# EAGLE schematic eCog_Buses_Template (EAGLE 6.6.0)
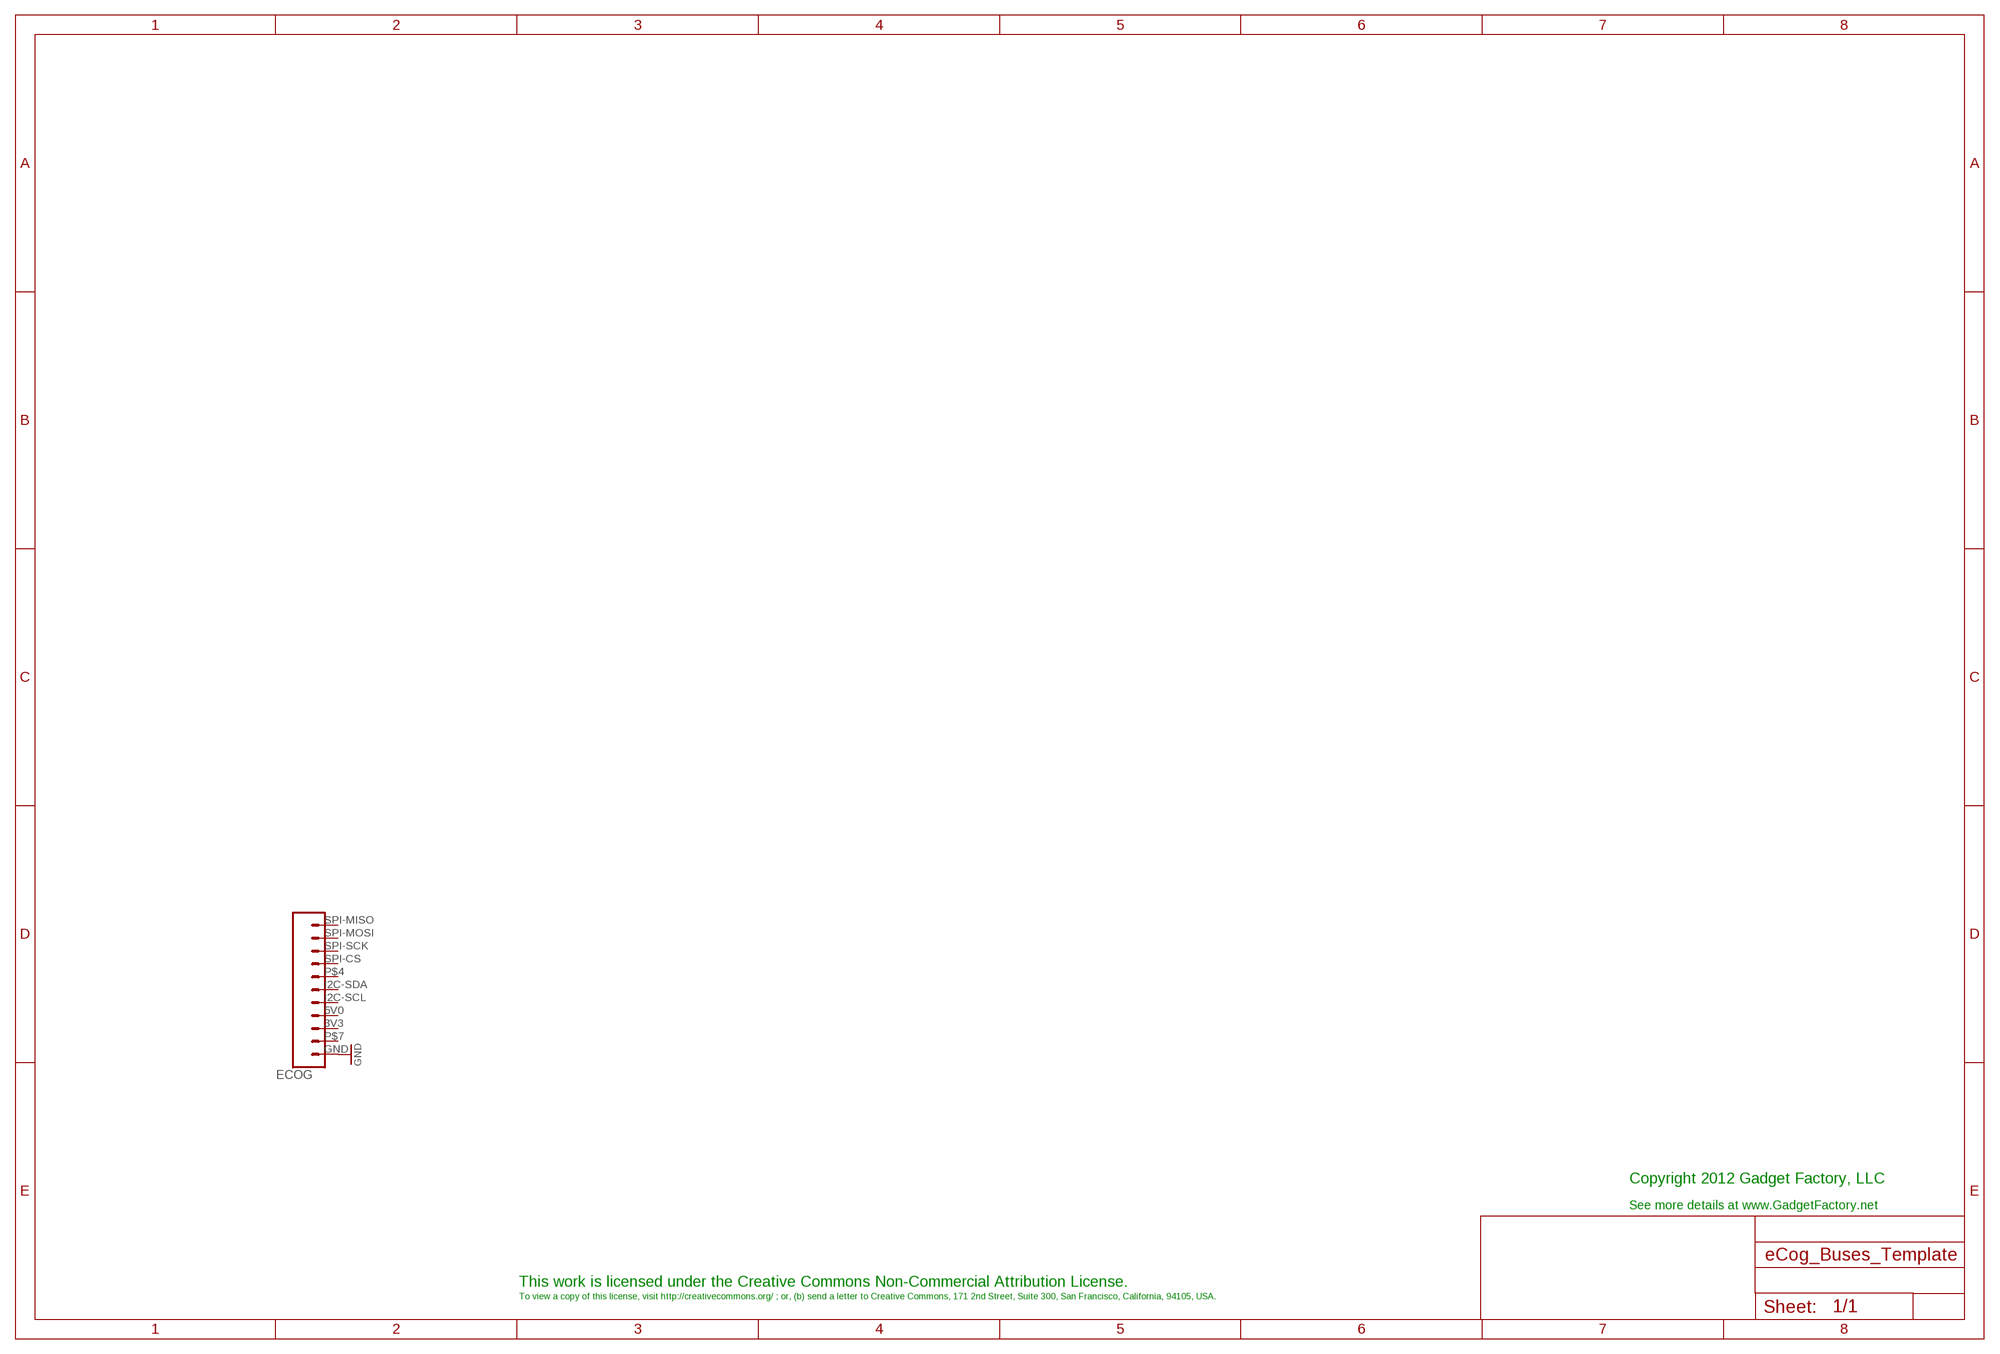
[diagram p0: schematic, sheet 1]

## Parts
ECOG  ECOG_BUSES_ROWECOG_BUSES_SMD  [ECOG_BUSES_SMD]

## Nets
GND: ECOG.GND
Unconnected: ECOG.3V3 ECOG.5V0(5V) ECOG.I2C-SCL(B6) ECOG.I2C-SDA(B5) ECOG.P$4(B4) ECOG.P$7(B7) ECOG.SPI-CS(B3) ECOG.SPI-MISO(B0) ECOG.SPI-MOSI(B1) ECOG.SPI-SCK(B2)

## Notes on the sheet
- Copyright 2012 Gadget Factory, LLC
- See more details at www.GadgetFactory.net
- This work is licensed under the Creative Commons Non-Commercial Attribution License.
- To view a copy of this license, visit http://creativecommons.org/ ; or, (b) send a letter to Creative Commons, 171 2nd Street, Suite 300, San Francisco, California, 94105, USA.

## Library data of the parts
ECOG = eCogs:ECOG_BUSES_ROW